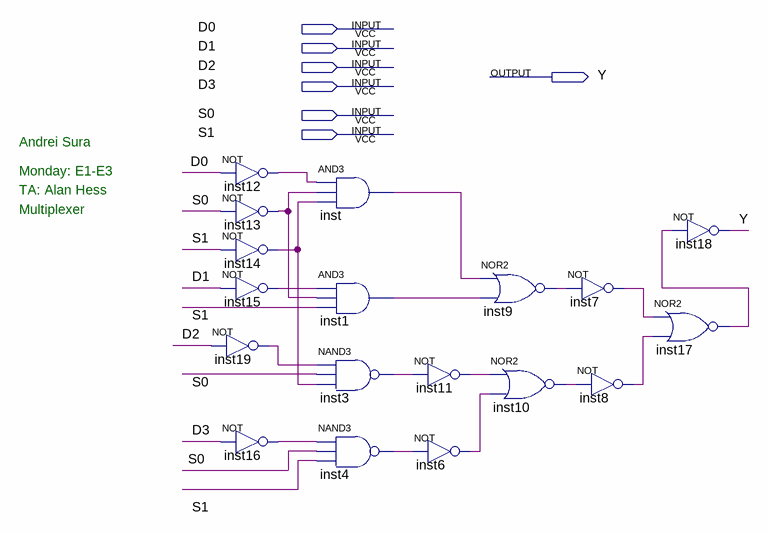
[diagram p0: schematic sheet]
// Quartus schematic lab_3_mux_demux.bdf as structural Verilog: 18 symbols, 7 pins
module lab_3_mux_demux (
  input  D0,
  input  D1,
  input  D2,
  input  D3,
  input  S0,
  input  S1,
  output Y
);

  wire inst1_out, inst3_out, inst4_out, inst6_out, inst7_out, inst8_out, inst9_out, inst10_out, inst11_out,
       inst12_out, inst13_out, inst14_out, inst15_out, inst16_out, inst17_out, inst19_out, inst_out;

  not inst12 (inst12_out, D0);
  not inst13 (inst13_out, S0);
  not inst14 (inst14_out, S1);
  not inst15 (inst15_out, D1);
  not inst19 (inst19_out, D2);
  not inst16 (inst16_out, D3);
  and inst (inst_out, inst12_out, inst13_out, inst14_out);
  and inst1 (inst1_out, inst15_out, inst13_out, S1);
  nand inst3 (inst3_out, inst19_out, S0, inst14_out);
  nand inst4 (inst4_out, inst16_out, S0, S1);
  not inst11 (inst11_out, inst3_out);
  not inst6 (inst6_out, inst4_out);
  nor inst9 (inst9_out, inst_out, inst1_out);
  nor inst10 (inst10_out, inst11_out, inst6_out);
  not inst7 (inst7_out, inst9_out);
  not inst8 (inst8_out, inst10_out);
  not inst18 (Y, inst17_out);
  nor inst17 (inst17_out, inst7_out, inst8_out);

  // Notes on the sheet:
  //   Andrei Sura
  //   Monday: E1-E3
  //   TA: Alan Hess
  //   Multiplexer
endmodule
